# EAGLE schematic Anti thept2ENGINE (EAGLE 7.6.0)
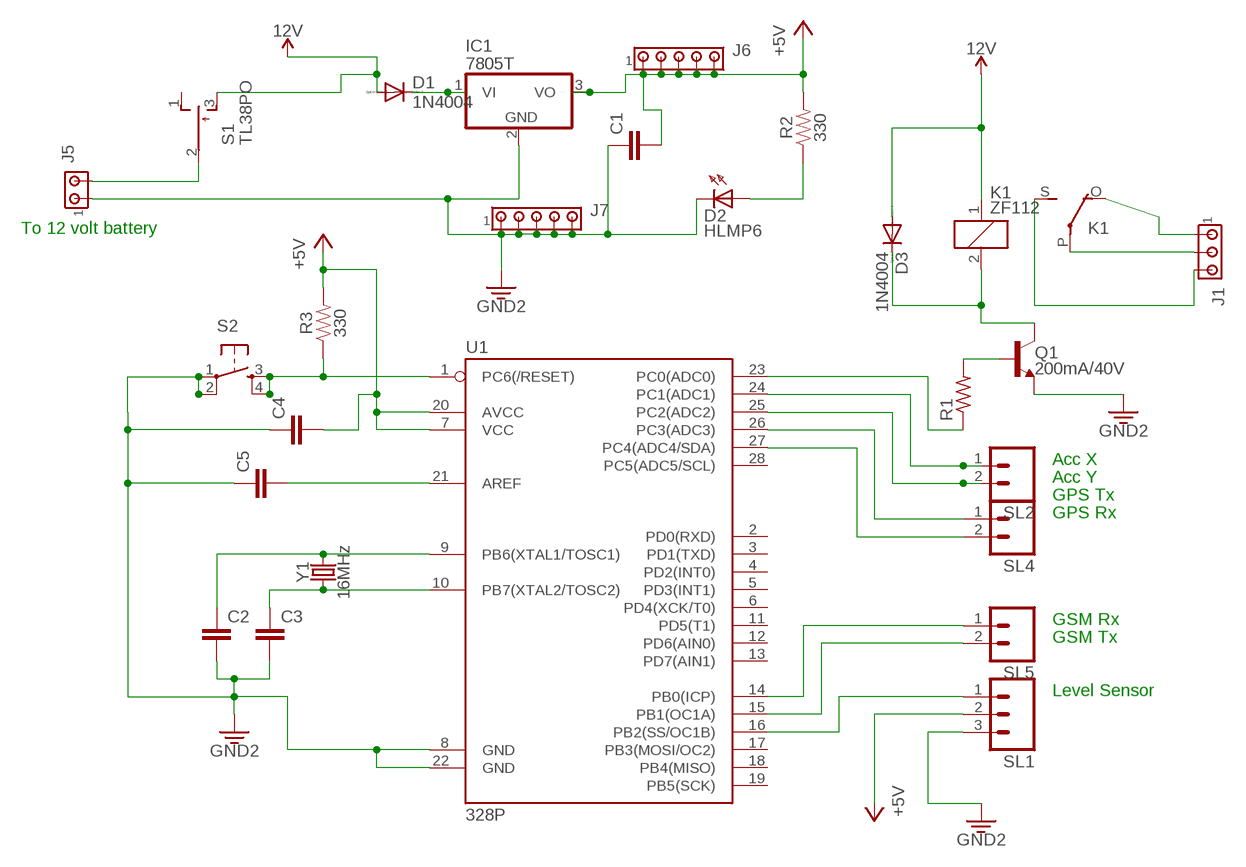
[diagram p0: schematic, sheet 1]

## Parts
C1  C5/2.5  [C5B2.5]
C2  C5/2.5  [C5B2.5]
C3  C5/2.5  [C5B2.5]
C4  C5/2.5  [C5B2.5]
C5  C5/2.5  [C5B2.5]
D1  1N4004  [DO41-10]
D2  HLMP6  [HLMP6]
D3  1N4004  [DO41-10]
IC1  7805T  [TO220H]
J1  MTA03-156  [1X3MTA]
J5  MTA02-156  [1X2MTA]
J6  MTA05-100  [10X05MTA]
J7  MTA05-100  [10X05MTA]
K1  ZF112  [ZF112]
Q1  200mA/40V  TRANS_NPN-2N3904  [TO-92]
R1  R-US_0204/7  [0204/7]
R2  330  330OHM-HORIZ-1/10W-5%  [AXIAL-0.3]
R3  330  330OHM-HORIZ-1/10W-5%  [AXIAL-0.3]
S1  TL38PO  [TL3XPO]
S2  TAC_SWITCHPTH  [TACTILE-PTH]
SL1  M03  [03P]
SL2  M02  [02P]
SL4  M02  [02P]
SL5  M02  [02P]
U1  328P  ATMEGA328P_PDIP  [DIP28]
Y1  16MHz  CRYSTAL-16MHZPTH-HC49US  [HC49US]

## Nets
3.3V: C1.1 C2.2 C3.2 C4.1 C5.1 D2.K IC1.2(GND) J5.1 J7.2 J7.3 J7.4 J7.5 Q1.1(E) SL1.3 U1.8(GND) U1.22(GND) ; supply symbol labelled GND2
12V: D1.A D3.A K1.1 S1.3(S)
+5V: C1.2 C4.2 IC1.3(VO) J6.1 J6.2 J6.3 J6.4 J6.5 R2.P$2 R3.P$2 SL1.2 U1.7(VCC) U1.20(AVCC)
N$1: J1.1 K1.O(2:O)
N$2: J1.2 K1.P(2:P)
N$3: Q1.2(B) R1.2
N$4: D3.C K1.2 Q1.3(C)
N$5: J1.3 K1.S(2:S)
N$6: R1.1 U1.23(PC0(ADC0))
N$7: D2.A R2.P$1
N$8: C3.1 U1.10(PB7(XTAL2/TOSC2)) Y1.1
N$9: SL2.1 U1.24(PC1(ADC1))
N$10: R3.P$1 S2.3 S2.4 U1.1(PC6(/RESET))
N$11: SL2.2 U1.25(PC2(ADC2))
N$12: C5.2 U1.21(AREF)
N$13: SL4.1 U1.26(PC3(ADC3))
N$14: J5.2 S1.2(P)
N$16: D1.C IC1.1(VI)
N$18: C2.1 U1.9(PB6(XTAL1/TOSC1)) Y1.2
N$19: SL4.2 U1.27(PC4(ADC4/SDA))
N$20: SL5.1 U1.14(PB0(ICP))
N$21: S2.1 S2.2
N$22: SL5.2 U1.15(PB1(OC1A))
N$23: SL1.1 U1.16(PB2(SS/OC1B))
Unconnected: J7.1 S1.1(O) U1.2(PD0(RXD)) U1.3(PD1(TXD)) U1.4(PD2(INT0)) U1.5(PD3(INT1)) U1.6(PD4(XCK/T0)) U1.11(PD5(T1)) U1.12(PD6(AIN0)) U1.13(PD7(AIN1)) U1.17(PB3(MOSI/OC2)) U1.18(PB4(MISO)) U1.19(PB5(SCK)) U1.28(PC5(ADC5/SCL))

## Notes on the sheet
- To 12 volt battery
- Acc X
- Acc Y
- GPS Tx
- GPS Rx
- GSM Rx
- GSM Tx
- Level Sensor

## Library data of the parts
C1-C5 = capacitor-wima:C: CAPACITOR naming: grid - package width
D1 D3 = diode:1N4004: DIODE general purpose rectifier, 1 A
D2 = display-hp:HLMP6: LED 2mm horizontal; MF: AGILENT TECHNOLOGIES; MPN: HLMP-6500; OC_FARNELL: 1652490; OC_NEWARK: 40K0088
IC1 = linear:78*: Positive VOLTAGE REGULATOR Source: http://cache.national.com/ds/LM/LM78L05.pdf http://www.fairchildsemi.com/ds/LM/LM7805.pdf
J1 = con-amp:MTA03-156: AMP connector
J5 = con-amp:MTA02-156: AMP connector
J6 J7 = con-amp:MTA05-100: AMP connector
K1 = relay:ZF112: RELAY 1 x switch; OC_FARNELL: unknown; OC_NEWARK: unknown
Q1 = SparkFun-DiscreteSemi:TRANS_NPN: NPN transistor Current controlled devices typically used to amplify current or used as a switch. BC547 - COM-08928 <http://www.sparkfun.com/products/8928> (TO-92 45V 100mA) (1.Collector 2.Base 3.Emitter) 2N3904 - COM-00521 <http://www.sparkfun.com/products/521> (TO-92 40V 200mA) (1.Emitter 2.Base 3.Collector) P2N2222A - COM-12852 <http://www.sparkfun.com/products/12852> (TO-92 40V 600mA) (1.Collector 2.Base 3.Emitter); PROD_ID: TRANS-08447
R1 = resistor:R-US_: RESISTOR, American symbol
R2 R3 = SparkFun-Resistors:330OHM: 330Ω resistor A resistor is a passive two-terminal electrical component that implements electrical resistance as a circuit element. Resistors act to reduce current flow, and, at the same time, act to lower voltage levels within circuits. - Wikipedia; PROD_ID: RES-8371
S1 = switch:TL38PO: TINY SWITCH ON OFF MOM Source: http://www2.produktinfo.conrad.com/datenblaetter/700000-724999/705152-da-01-de-Subminiaturschalter_TL_36YO.pdf
S2 = SparkFun-Retired:TAC_SWITCH: Momentary Switch Button commonly used for reset or general input. Spark Fun Electronics SKU : COM-00097 SMT- SWCH-08247
SL1 = con-amp-quick:M03: AMP QUICK CONNECTOR; OC_FARNELL: unknown; OC_NEWARK: unknown
SL2 SL4 SL5 = con-amp-quick:M02: AMP QUICK CONNECTOR; OC_FARNELL: unknown; OC_NEWARK: unknown
U1 = SparkFun-IC-Microcontroller:ATMEGA328P_PDIP: Atmel 328P Through hole ATMEGA328P uC used in the Arduino 32kb flash, 1k EEPROM, 2k SRAM Datasheet <http://www.sparkfun.com/datasheets/Components/SMD/ATMega328.pdf> SparkFun Products Storefront component: AVR 28 Pin 20MHz 32K 6A/D - ATMega328P <https://www.sparkfun.com/products/9061> (COM-09061) SparkFun Simon Says - Through-Hole Soldering Kit <https://www.sparkfun.com/products/10547> (KIT-10547) SparkFun Learn to Solder - Simon Says <https://www.sparkfun.com/products/13708> (KIT-13708) SparkFun BigTime Watch Kit <https://www.sparkfun.com/products/11734> (KIT-11734) SparkFun ClockIt <https://www.sparkfun.com/products/10930> (KIT-10930) SparkFun Serial Enabled LCD Kit <https://www.sparkfun.com/products/10097> (LCD-10097) SparkFun Simon Tilts - Through Hole Soldering Kit <https://www.sparkfun.com/products/12634> (KIT-12634) SparkFun Frequency Counter Kit <https://www.sparkfun.com/products/10140> (KIT-10140) FabFM Radio Kit <https://www.sparkfun.com/products/11043> (KIT-11043) SparkFun Binary Blaster Kit <https://www.sparkfun.com/products/12037> (KIT-12037) SparkFun Metro-Gnome <https://www.sparkfun.com/products/9236> (KIT-09236) ATmega328 with Arduino Optiboot (Uno) <https://www.sparkfun.com/products/10524> (DEV-10524); PROD_ID: IC-09136
Y1 = SparkFun-Clocks:CRYSTAL-16MHZ: 16MHz Crystal Digikey Example <http://www.digikey.com/product-search/en?keywords=535-9122-1-ND> Frequency: 16MHz Frequency Stability: ±50ppm Frequency Tolerance: ±20ppm Load Capacitance: 18pF SparkFun Products: Pro Micro -5V/16MHz <https://www.sparkfun.com/products/12640> SparkFun Serial Enabled LCD Kit <https://www.sparkfun.com/products/10097>; PROD_ID: XTAL-08181; SF_ID: COM-00536